# EAGLE design breakout (EAGLE 9.4.2)
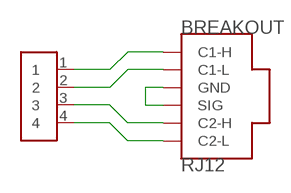
[diagram p0: schematic, sheet 1]

## Parts
BREAKOUT  RJ12  [RJ12]
U$1  TERMINAL_BLOCK  [TERMINALBLOCK-4]

## Nets
N$1: BREAKOUT.3(GND) BREAKOUT.4(SIG)
N$2: BREAKOUT.1(C1-H) U$1.1
N$3: BREAKOUT.2(C1-L) U$1.2
N$4: BREAKOUT.5(C2-H) U$1.3
N$5: BREAKOUT.6(C2-L) U$1.4

## Library data of the parts
BREAKOUT = components:RJ12
U$1 = components:TERMINAL_BLOCK

## Board
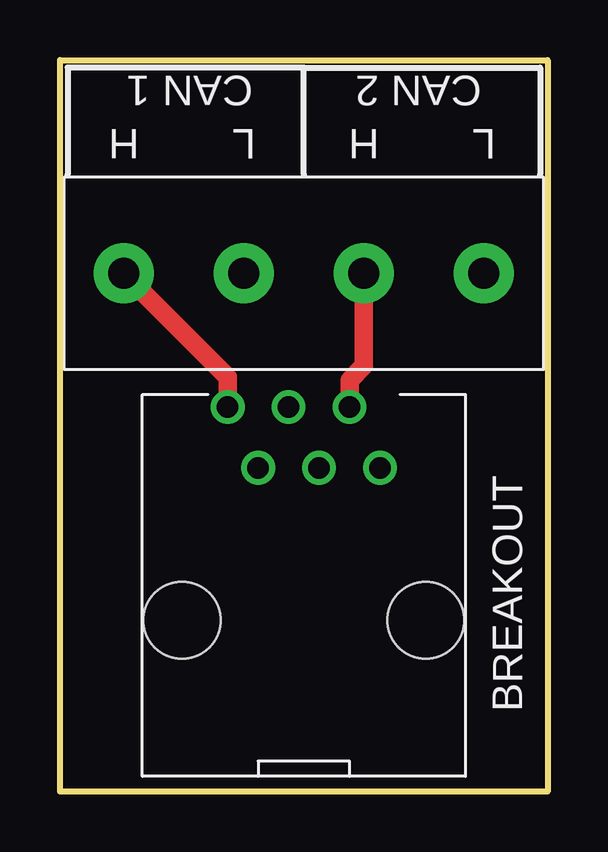
[diagram p1: board, top side]
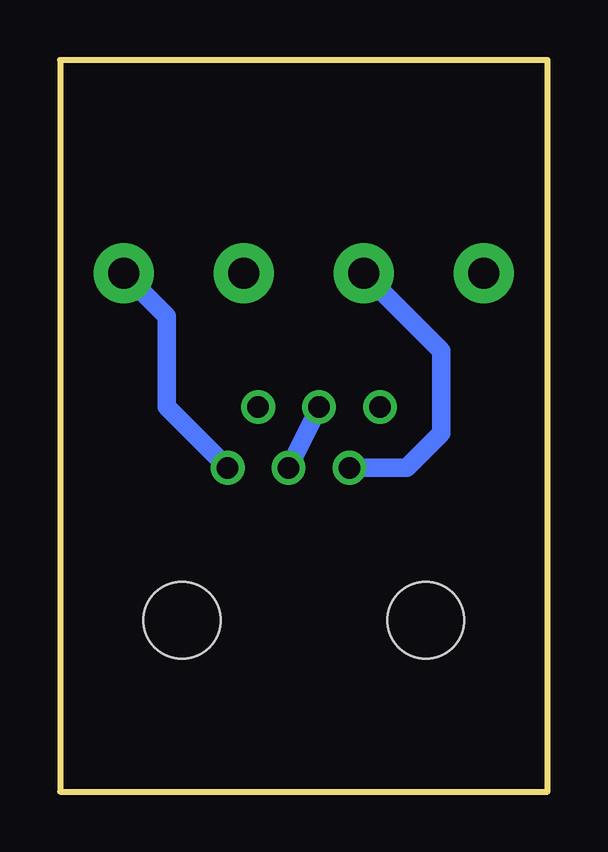
[diagram p2: board, bottom side, seen from below]

Size 20.32 x 30.48 mm. Coordinates in mm from the lower left corner, seen from the top.
Outline: 0,0 0,30.48 20.32,30.48 20.32,0 0,0
Copper layers (1*16): Top 0.035mm / dielectric 1.5mm / Bottom 0.035mm
Design rules "default": minimum track width 6mil, minimum drill 0.35mm, track to track 6mil, track to pad 6mil, pad to pad 6mil, via to via 6mil, smd to smd 6mil, copper to edge 40mil, drill to drill 6mil, minimum pad ring 10mil, minimum via ring 8mil, stop-mask expansion 4mil, vias tented up to drill 0mil, thermal gap 10mil

### Footprints (pad centres in the part's own frame; a part is rotated, then mirrored left to right if it is on the bottom)
RJ12 = drill 0.9: 1 3.175,-15.39; 2 1.905,-12.85; 3 0.635,-15.39; 4 -0.635,-12.85; 5 -1.905,-15.39; 6 -3.175,-12.85 | hole 3.2: -5.08,-6.5; 5.08,-6.5
TERMINALBLOCK-4 = drill 1.3 pad 2.5: 1 -7.5,0; 2 -2.5,0; 3 2.5,0; 4 7.5,0

### Placement (x,y rotation side)
BREAKOUT  10.16,0.64 180 top
U$1  10.16,21.59 0 top

### Tracks (layer width: path | path; a pad name or v marks a point on that pad's centre or on a via)
N$1
  Bottom 0.762: BREAKOUT.3 BREAKOUT.4
N$2
  Top 0.762: U$1.1 6.99,17.27 BREAKOUT.1
N$3
  Bottom 0.762: BREAKOUT.2 5.88,13.48 4.45,14.92 4.45,18.38 U$1.2
N$4
  Top 0.762: BREAKOUT.5 12.06,17.14 12.66,17.74 U$1.3
N$5
  Bottom 0.762: BREAKOUT.6 15.88,16.02 15.88,19.8 U$1.4

### Text on the board
tPlace: CAN 1 | CAN 2 | H | L | H | L